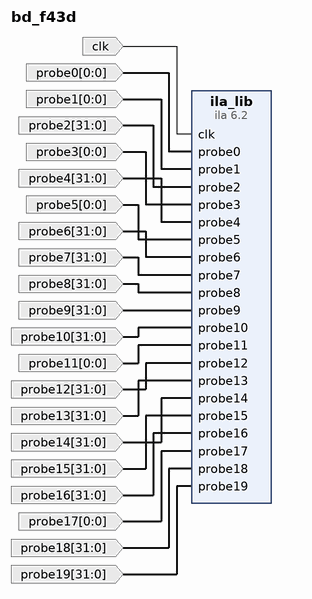
[diagram p0: block diagram of the top level]
# Vivado block design bd_f43d, xc7z020clg400-1, Vivado 2017.4
create_bd_design bd_f43d

create_bd_port -dir I -type clk clk
create_bd_port -dir I -from 0 -to 0 probe0
create_bd_port -dir I -from 0 -to 0 probe1
create_bd_port -dir I -from 31 -to 0 probe2
create_bd_port -dir I -from 0 -to 0 probe3
create_bd_port -dir I -from 31 -to 0 probe4
create_bd_port -dir I -from 0 -to 0 probe5
create_bd_port -dir I -from 31 -to 0 probe6
create_bd_port -dir I -from 31 -to 0 probe7
create_bd_port -dir I -from 31 -to 0 probe8
create_bd_port -dir I -from 31 -to 0 probe9
create_bd_port -dir I -from 31 -to 0 probe10
create_bd_port -dir I -from 0 -to 0 probe11
create_bd_port -dir I -from 31 -to 0 probe12
create_bd_port -dir I -from 31 -to 0 probe13
create_bd_port -dir I -from 31 -to 0 probe14
create_bd_port -dir I -from 31 -to 0 probe15
create_bd_port -dir I -from 31 -to 0 probe16
create_bd_port -dir I -from 0 -to 0 probe17
create_bd_port -dir I -from 31 -to 0 probe18
create_bd_port -dir I -from 31 -to 0 probe19

create_bd_cell -type ip -vlnv xilinx.com:ip:ila:6.2 ila_lib
set_property -dict [list \
  CONFIG.C_PROBE19_TYPE 1 \
  CONFIG.C_PROBE18_TYPE 1 \
  CONFIG.C_PROBE17_TYPE 1 \
  CONFIG.C_PROBE16_TYPE 1 \
  CONFIG.C_PROBE15_TYPE 1 \
  CONFIG.C_PROBE14_TYPE 1 \
  CONFIG.C_PROBE13_TYPE 1 \
  CONFIG.C_PROBE12_TYPE 1 \
  CONFIG.C_PROBE11_TYPE 1 \
  CONFIG.C_PROBE10_TYPE 1 \
  CONFIG.C_PROBE9_TYPE 1 \
  CONFIG.C_PROBE8_TYPE 1 \
  CONFIG.C_PROBE7_TYPE 1 \
  CONFIG.C_PROBE6_TYPE 1 \
  CONFIG.C_PROBE5_TYPE 1 \
  CONFIG.C_PROBE4_TYPE 1 \
  CONFIG.C_PROBE3_TYPE 1 \
  CONFIG.C_PROBE2_TYPE 1 \
  CONFIG.C_PROBE1_TYPE 1 \
  CONFIG.C_PROBE0_TYPE 1 \
  CONFIG.C_PROBE19_WIDTH 32 \
  CONFIG.C_PROBE18_WIDTH 32 \
  CONFIG.C_PROBE17_WIDTH 1 \
  CONFIG.C_PROBE16_WIDTH 32 \
  CONFIG.C_PROBE15_WIDTH 32 \
  CONFIG.C_PROBE14_WIDTH 32 \
  CONFIG.C_PROBE13_WIDTH 32 \
  CONFIG.C_PROBE12_WIDTH 32 \
  CONFIG.C_PROBE11_WIDTH 1 \
  CONFIG.C_PROBE10_WIDTH 32 \
  CONFIG.C_PROBE9_WIDTH 32 \
  CONFIG.C_PROBE8_WIDTH 32 \
  CONFIG.C_PROBE7_WIDTH 32 \
  CONFIG.C_PROBE6_WIDTH 32 \
  CONFIG.C_PROBE5_WIDTH 1 \
  CONFIG.C_PROBE4_WIDTH 32 \
  CONFIG.C_PROBE3_WIDTH 1 \
  CONFIG.C_PROBE2_WIDTH 32 \
  CONFIG.C_PROBE1_WIDTH 1 \
  CONFIG.C_PROBE0_WIDTH 1 \
  CONFIG.C_DATA_DEPTH 1024 \
  CONFIG.C_NUM_OF_PROBES 20 \
  CONFIG.C_XLNX_HW_PROBE_INFO DEFAULT \
  CONFIG.C_TRIGOUT_EN false \
  CONFIG.C_EN_STRG_QUAL 0 \
  CONFIG.C_EN_TIME_TAG 0 \
  CONFIG.C_TIME_TAG_WIDTH 32 \
  CONFIG.C_INPUT_PIPE_STAGES 0 \
  CONFIG.C_ILA_CLK_FREQ 100000000 \
  CONFIG.C_ADV_TRIGGER FALSE \
  CONFIG.C_PROBE19_MU_CNT 1 \
  CONFIG.C_PROBE18_MU_CNT 1 \
  CONFIG.C_PROBE17_MU_CNT 1 \
  CONFIG.C_PROBE16_MU_CNT 1 \
  CONFIG.C_PROBE15_MU_CNT 1 \
  CONFIG.C_PROBE14_MU_CNT 1 \
  CONFIG.C_PROBE13_MU_CNT 1 \
  CONFIG.C_PROBE12_MU_CNT 1 \
  CONFIG.C_PROBE11_MU_CNT 1 \
  CONFIG.C_PROBE10_MU_CNT 1 \
  CONFIG.C_PROBE9_MU_CNT 1 \
  CONFIG.C_PROBE8_MU_CNT 1 \
  CONFIG.C_PROBE7_MU_CNT 1 \
  CONFIG.C_PROBE6_MU_CNT 1 \
  CONFIG.C_PROBE5_MU_CNT 1 \
  CONFIG.C_PROBE4_MU_CNT 1 \
  CONFIG.C_PROBE3_MU_CNT 1 \
  CONFIG.C_PROBE2_MU_CNT 1 \
  CONFIG.C_PROBE1_MU_CNT 1 \
  CONFIG.C_PROBE0_MU_CNT 1 \
  CONFIG.C_TRIGIN_EN false \
  CONFIG.ALL_PROBE_SAME_MU TRUE \
  CONFIG.ALL_PROBE_SAME_MU_CNT 1 \
  CONFIG.C_MONITOR_TYPE Native \
] [get_bd_cells ila_lib]

# ---- connections ----

connect_bd_net [get_bd_ports clk] [get_bd_pins ila_lib/clk]
connect_bd_net -net probe0_1 [get_bd_ports probe0] [get_bd_pins ila_lib/probe0]
connect_bd_net -net probe1_1 [get_bd_ports probe1] [get_bd_pins ila_lib/probe1]
connect_bd_net -net probe2_1 [get_bd_ports probe2] [get_bd_pins ila_lib/probe2]
connect_bd_net -net probe3_1 [get_bd_ports probe3] [get_bd_pins ila_lib/probe3]
connect_bd_net -net probe4_1 [get_bd_ports probe4] [get_bd_pins ila_lib/probe4]
connect_bd_net -net probe5_1 [get_bd_ports probe5] [get_bd_pins ila_lib/probe5]
connect_bd_net -net probe6_1 [get_bd_ports probe6] [get_bd_pins ila_lib/probe6]
connect_bd_net -net probe7_1 [get_bd_ports probe7] [get_bd_pins ila_lib/probe7]
connect_bd_net -net probe8_1 [get_bd_ports probe8] [get_bd_pins ila_lib/probe8]
connect_bd_net -net probe9_1 [get_bd_ports probe9] [get_bd_pins ila_lib/probe9]
connect_bd_net -net probe10_1 [get_bd_ports probe10] [get_bd_pins ila_lib/probe10]
connect_bd_net -net probe11_1 [get_bd_ports probe11] [get_bd_pins ila_lib/probe11]
connect_bd_net -net probe12_1 [get_bd_ports probe12] [get_bd_pins ila_lib/probe12]
connect_bd_net -net probe13_1 [get_bd_ports probe13] [get_bd_pins ila_lib/probe13]
connect_bd_net -net probe14_1 [get_bd_ports probe14] [get_bd_pins ila_lib/probe14]
connect_bd_net -net probe15_1 [get_bd_ports probe15] [get_bd_pins ila_lib/probe15]
connect_bd_net -net probe16_1 [get_bd_ports probe16] [get_bd_pins ila_lib/probe16]
connect_bd_net -net probe17_1 [get_bd_ports probe17] [get_bd_pins ila_lib/probe17]
connect_bd_net -net probe18_1 [get_bd_ports probe18] [get_bd_pins ila_lib/probe18]
connect_bd_net -net probe19_1 [get_bd_ports probe19] [get_bd_pins ila_lib/probe19]

validate_bd_design
save_bd_design
